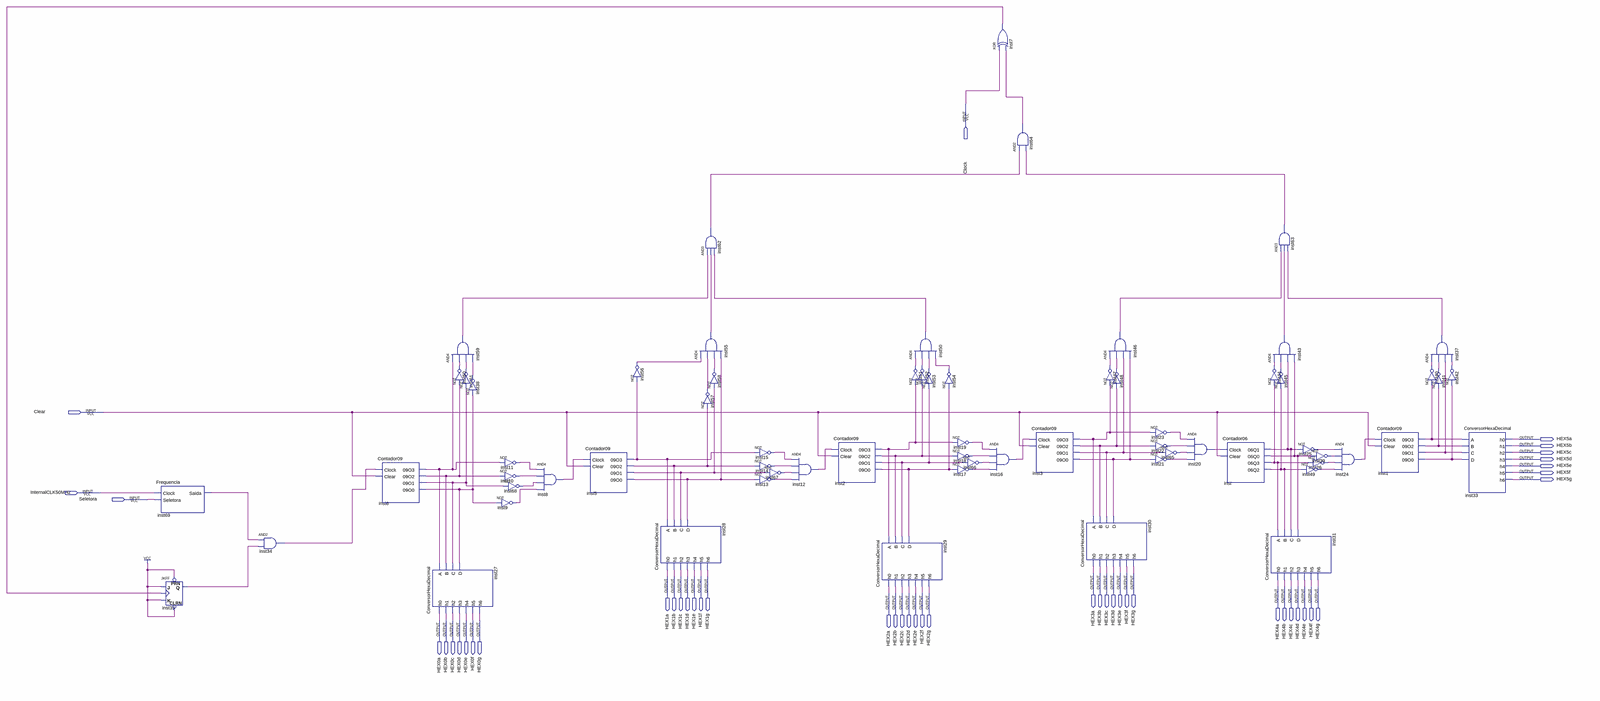
[diagram p0: schematic sheet, whole]
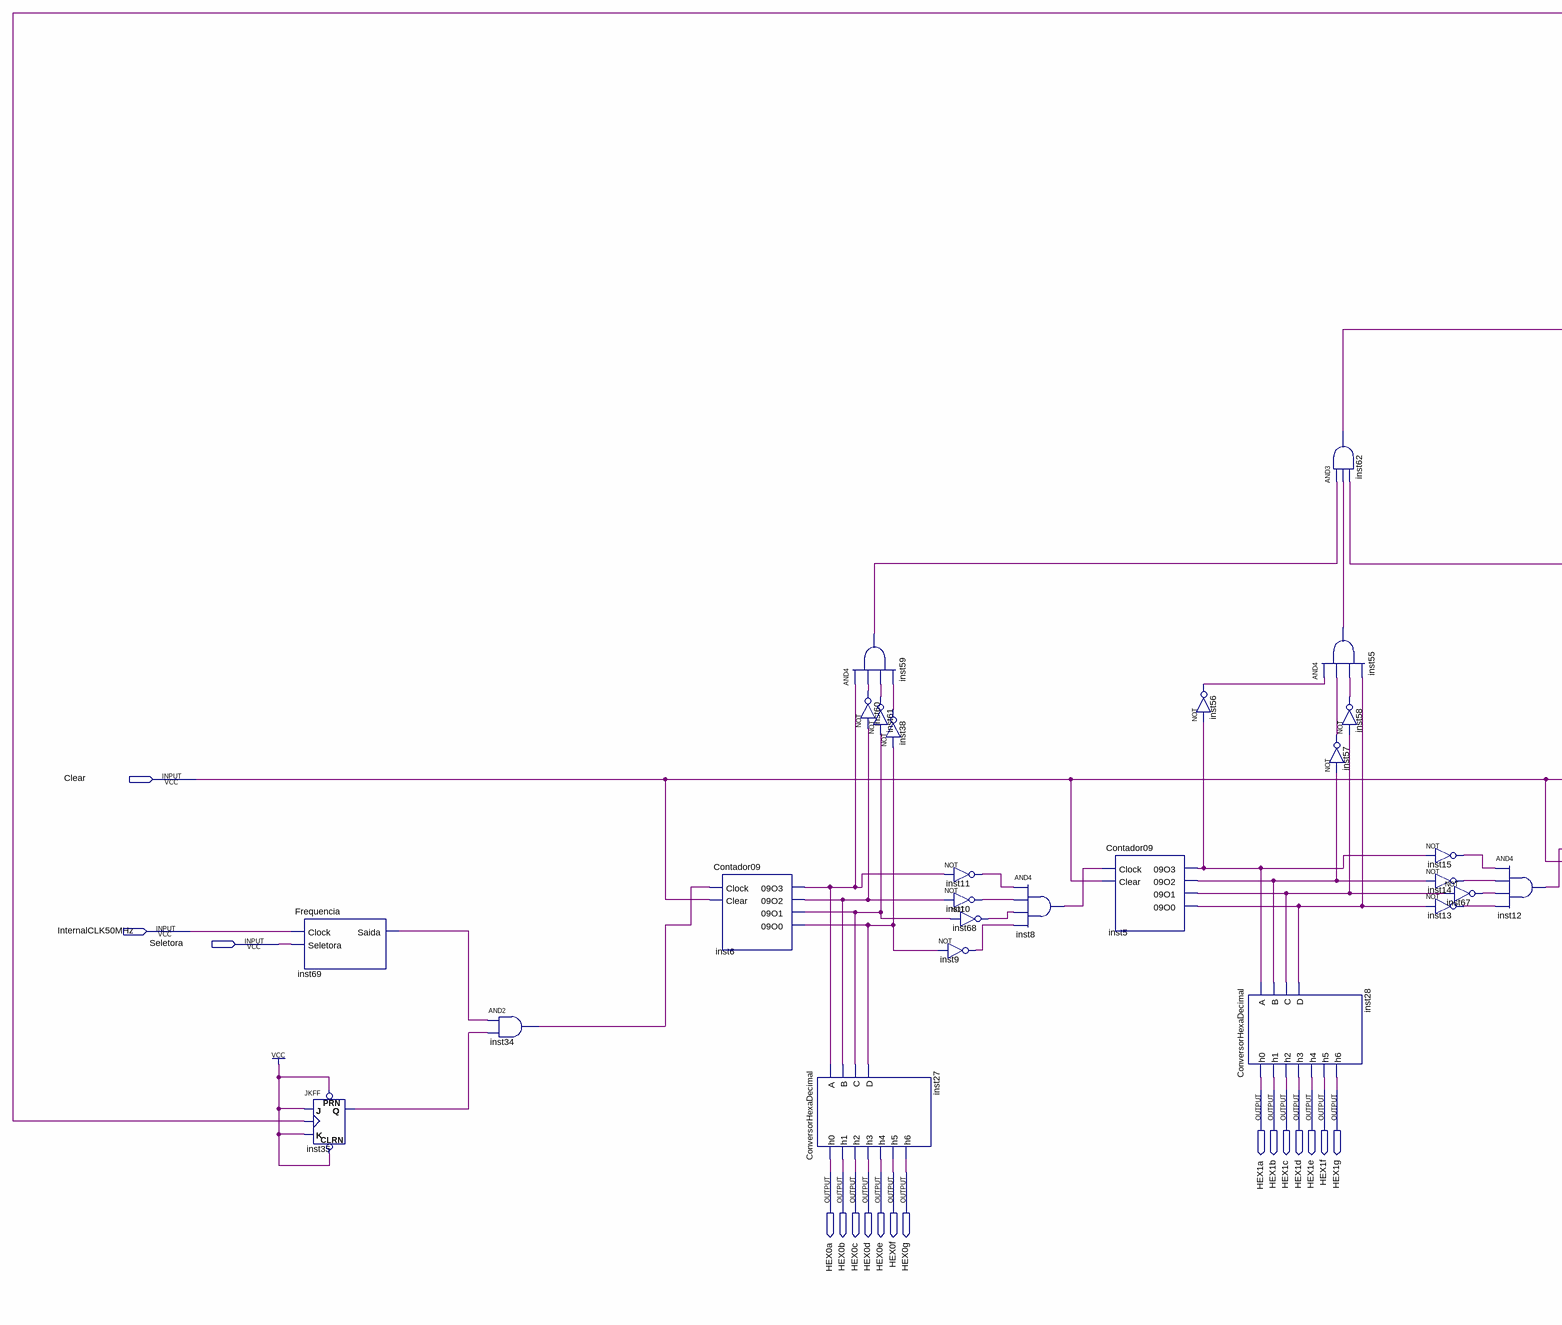
[diagram p1: schematic sheet, left part]
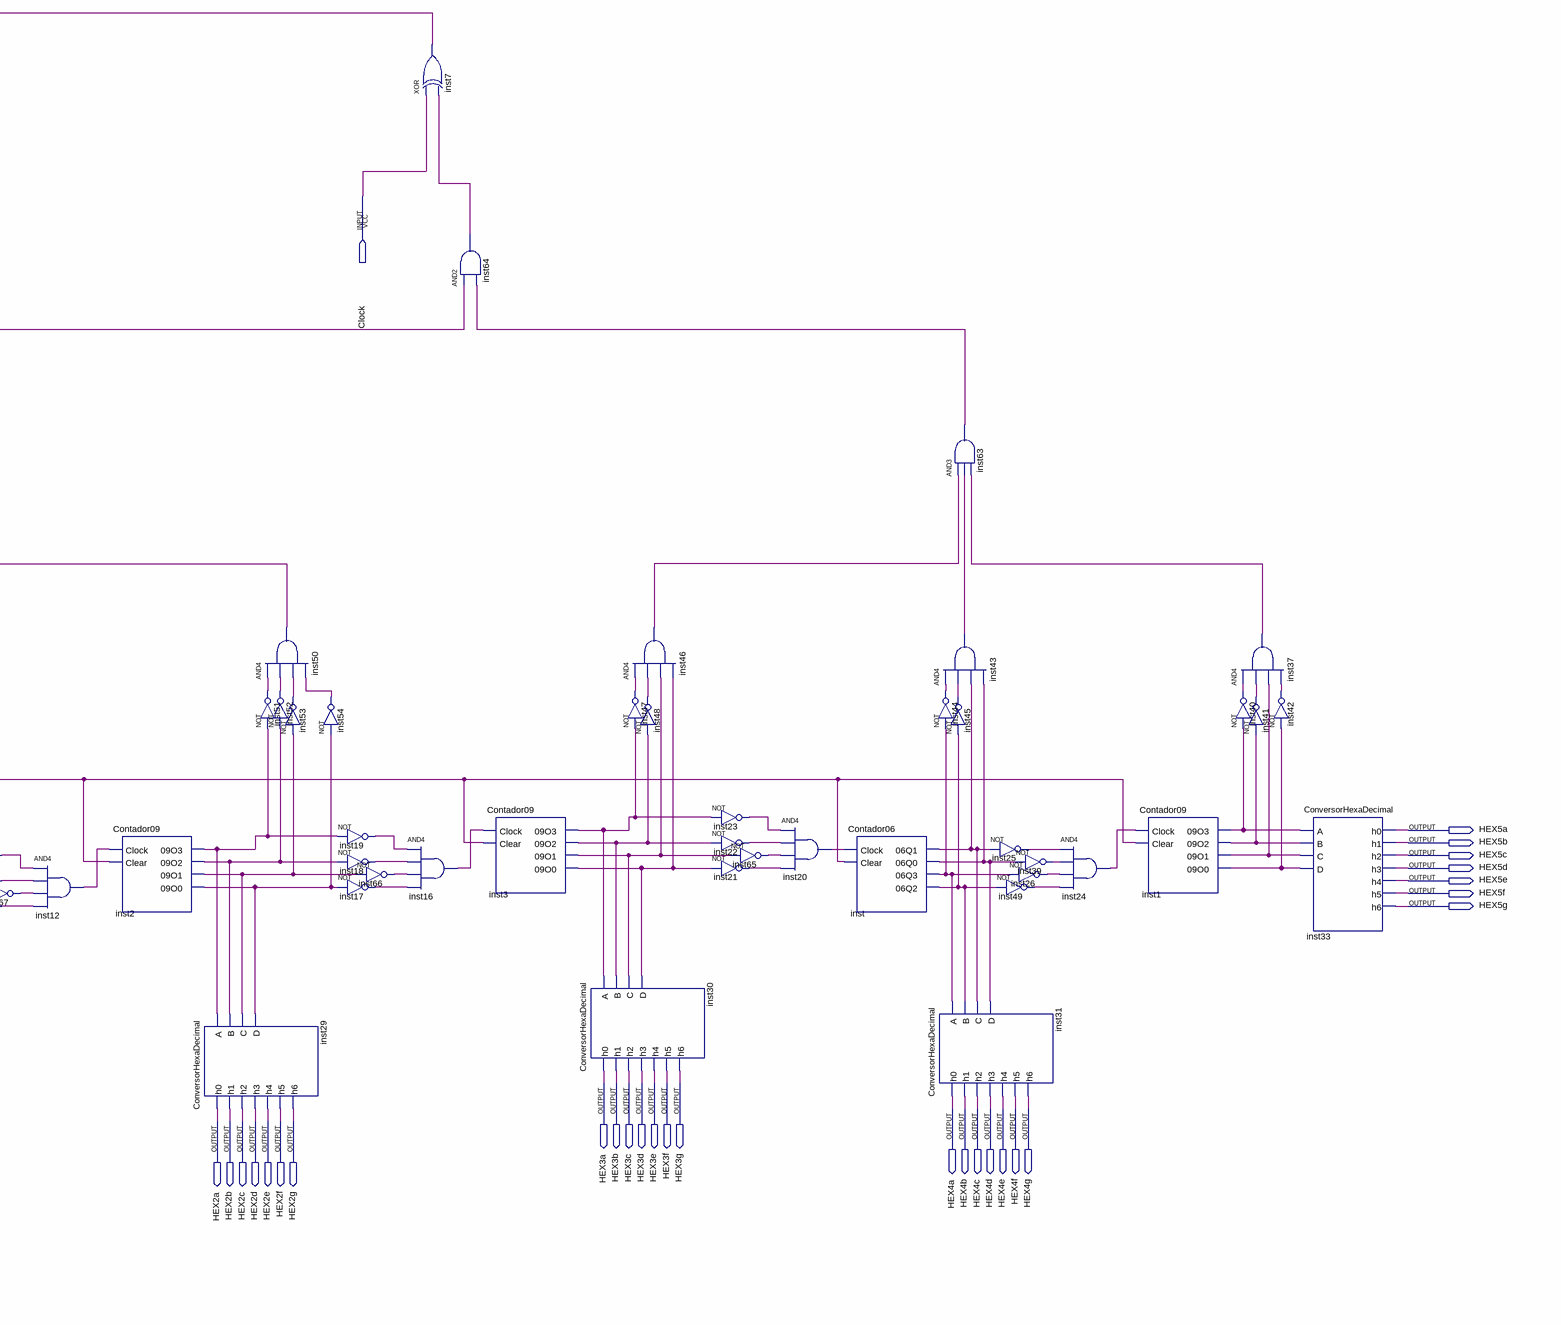
[diagram p2: schematic sheet, right part]
// Quartus schematic LAB5A.bdf as structural Verilog: 67 symbols, 46 pins
module LAB5A (
  input  Clock,
  input  Clear,
  input  InternalCLK50MHz,
  input  Seletora,
  output HEX5a,
  output HEX5b,
  output HEX5c,
  output HEX5d,
  output HEX5e,
  output HEX5f,
  output HEX5g,
  output HEX3a,
  output HEX3b,
  output HEX3c,
  output HEX3d,
  output HEX3e,
  output HEX3f,
  output HEX3g,
  output HEX1a,
  output HEX1b,
  output HEX1c,
  output HEX1d,
  output HEX1e,
  output HEX1f,
  output HEX1g,
  output HEX4a,
  output HEX4b,
  output HEX4c,
  output HEX4d,
  output HEX4e,
  output HEX4f,
  output HEX4g,
  output HEX2a,
  output HEX2b,
  output HEX2c,
  output HEX2d,
  output HEX2e,
  output HEX2f,
  output HEX2g,
  output HEX0a,
  output HEX0b,
  output HEX0c,
  output HEX0d,
  output HEX0e,
  output HEX0f,
  output HEX0g
);

  wire inst1_09o0, inst1_09o1, inst1_09o2, inst1_09o3, inst2_09o0, inst2_09o1, inst2_09o2, inst2_09o3,
       inst3_09o0, inst3_09o1, inst3_09o2, inst3_09o3, inst5_09o0, inst5_09o1, inst5_09o2, inst5_09o3,
       inst6_09o0, inst6_09o1, inst6_09o2, inst6_09o3, inst7_out, inst8_out, inst9_out, inst10_out,
       inst11_out, inst12_out, inst13_out, inst14_out, inst15_out, inst16_out, inst17_out, inst18_out,
       inst19_out, inst20_out, inst21_out, inst22_out, inst23_out, inst24_out, inst25_out, inst26_out,
       inst34_out, inst35_q, inst37_out, inst38_out, inst39_out, inst40_out, inst41_out, inst42_out,
       inst43_out, inst44_out, inst45_out, inst46_out, inst47_out, inst48_out, inst49_out, inst50_out,
       inst51_out, inst52_out, inst53_out, inst54_out, inst55_out, inst56_out, inst57_out, inst58_out,
       inst59_out, inst60_out, inst61_out, inst62_out, inst63_out, inst64_out, inst65_out, inst66_out,
       inst67_out, inst68_out, inst69_saida, inst_06q0, inst_06q1, inst_06q2, inst_06q3;

  Frequencia inst69 (.Clock(InternalCLK50MHz), .Seletora(Seletora), .Saida(inst69_saida));
  JKFF inst35 (.PRN(1'b1), .CLRN(1'b1), .K(1'b1), .J(1'b1), .CLK(inst7_out), .Q(inst35_q));
  and inst34 (inst34_out, inst69_saida, inst35_q);
  Contador09 inst6 (
    .Clock(inst34_out), .Clear(Clear), .\09O3 (inst6_09o3), .\09O2 (inst6_09o2), .\09O1 (inst6_09o1),
    .\09O0 (inst6_09o0));
  and inst59 (inst59_out, inst6_09o3, inst60_out, inst61_out, inst38_out);
  ConversorHexaDecimal inst27 (
    .A(inst6_09o3), .B(inst6_09o2), .C(inst6_09o1), .D(inst6_09o0), .h0(HEX0a), .h1(HEX0b), .h2(HEX0c),
    .h3(HEX0d), .h4(HEX0e), .h5(HEX0f), .h6(HEX0g));
  not inst60 (inst60_out, inst6_09o2);
  not inst61 (inst61_out, inst6_09o1);
  not inst38 (inst38_out, inst6_09o0);
  not inst11 (inst11_out, inst6_09o3);
  not inst10 (inst10_out, inst6_09o2);
  not inst68 (inst68_out, inst6_09o1);
  not inst9 (inst9_out, inst6_09o0);
  and inst8 (inst8_out, inst11_out, inst10_out, inst68_out, inst9_out);
  Contador09 inst5 (
    .Clock(inst8_out), .Clear(Clear), .\09O3 (inst5_09o3), .\09O2 (inst5_09o2), .\09O1 (inst5_09o1),
    .\09O0 (inst5_09o0));
  not inst56 (inst56_out, inst5_09o3);
  ConversorHexaDecimal inst28 (
    .A(inst5_09o3), .B(inst5_09o2), .C(inst5_09o1), .D(inst5_09o0), .h0(HEX1a), .h1(HEX1b), .h2(HEX1c),
    .h3(HEX1d), .h4(HEX1e), .h5(HEX1f), .h6(HEX1g));
  and inst62 (inst62_out, inst59_out, inst55_out, inst50_out);
  and inst55 (inst55_out, inst56_out, inst57_out, inst58_out, inst5_09o0);
  not inst58 (inst58_out, inst5_09o1);
  not inst57 (inst57_out, inst5_09o2);
  not inst15 (inst15_out, inst5_09o3);
  not inst14 (inst14_out, inst5_09o2);
  not inst67 (inst67_out, inst5_09o1);
  not inst13 (inst13_out, inst5_09o0);
  and inst12 (inst12_out, inst15_out, inst14_out, inst67_out, inst13_out);
  Contador09 inst2 (
    .Clock(inst12_out), .Clear(Clear), .\09O3 (inst2_09o3), .\09O2 (inst2_09o2), .\09O1 (inst2_09o1),
    .\09O0 (inst2_09o0));
  ConversorHexaDecimal inst29 (
    .A(inst2_09o3), .B(inst2_09o2), .C(inst2_09o1), .D(inst2_09o0), .h0(HEX2a), .h1(HEX2b), .h2(HEX2c),
    .h3(HEX2d), .h4(HEX2e), .h5(HEX2f), .h6(HEX2g));
  and inst50 (inst50_out, inst51_out, inst52_out, inst53_out, inst54_out);
  not inst51 (inst51_out, inst2_09o3);
  not inst52 (inst52_out, inst2_09o2);
  not inst53 (inst53_out, inst2_09o1);
  not inst54 (inst54_out, inst2_09o0);
  not inst19 (inst19_out, inst2_09o3);
  not inst18 (inst18_out, inst2_09o2);
  not inst17 (inst17_out, inst2_09o0);
  not inst66 (inst66_out, inst2_09o1);
  xor inst7 (inst7_out, Clock, inst64_out);
  and inst64 (inst64_out, inst62_out, inst63_out);
  and inst16 (inst16_out, inst19_out, inst18_out, inst66_out, inst17_out);
  Contador09 inst3 (
    .Clock(inst16_out), .Clear(Clear), .\09O3 (inst3_09o3), .\09O2 (inst3_09o2), .\09O1 (inst3_09o1),
    .\09O0 (inst3_09o0));
  ConversorHexaDecimal inst30 (
    .A(inst3_09o3), .B(inst3_09o2), .C(inst3_09o1), .D(inst3_09o0), .h0(HEX3a), .h1(HEX3b), .h2(HEX3c),
    .h3(HEX3d), .h4(HEX3e), .h5(HEX3f), .h6(HEX3g));
  and inst46 (inst46_out, inst47_out, inst48_out, inst3_09o1, inst3_09o0);
  not inst47 (inst47_out, inst3_09o3);
  not inst48 (inst48_out, inst3_09o2);
  not inst23 (inst23_out, inst3_09o3);
  not inst22 (inst22_out, inst3_09o2);
  not inst65 (inst65_out, inst3_09o1);
  not inst21 (inst21_out, inst3_09o0);
  and inst20 (inst20_out, inst23_out, inst22_out, inst65_out, inst21_out);
  Contador06 inst (
    .Clock(inst20_out), .Clear(Clear), .\06Q1 (inst_06q1), .\06Q0 (inst_06q0), .\06Q3 (inst_06q3),
    .\06Q2 (inst_06q2));
  and inst63 (inst63_out, inst46_out, inst43_out, inst37_out);
  and inst43 (inst43_out, inst44_out, inst45_out, inst_06q1, inst_06q0);
  not inst44 (inst44_out, inst_06q3);
  not inst45 (inst45_out, inst_06q2);
  ConversorHexaDecimal inst31 (
    .A(inst_06q3), .B(inst_06q2), .C(inst_06q1), .D(inst_06q0), .h0(HEX4a), .h1(HEX4b), .h2(HEX4c),
    .h3(HEX4d), .h4(HEX4e), .h5(HEX4f), .h6(HEX4g));
  not inst25 (inst25_out, inst_06q1);
  not inst26 (inst26_out, inst_06q3);
  not inst49 (inst49_out, inst_06q2);
  and inst24 (inst24_out, inst25_out, inst39_out, inst26_out, inst49_out);
  not inst39 (inst39_out, inst_06q0);
  Contador09 inst1 (
    .Clock(inst24_out), .Clear(Clear), .\09O3 (inst1_09o3), .\09O2 (inst1_09o2), .\09O1 (inst1_09o1),
    .\09O0 (inst1_09o0));
  and inst37 (inst37_out, inst40_out, inst41_out, inst1_09o1, inst42_out);
  not inst40 (inst40_out, inst1_09o3);
  not inst41 (inst41_out, inst1_09o2);
  not inst42 (inst42_out, inst1_09o0);
  ConversorHexaDecimal inst33 (
    .A(inst1_09o3), .B(inst1_09o2), .C(inst1_09o1), .D(inst1_09o0), .h0(HEX5a), .h1(HEX5b), .h2(HEX5c),
    .h3(HEX5d), .h4(HEX5e), .h5(HEX5f), .h6(HEX5g));
endmodule
